# EAGLE schematic ArduFrauenfelderCNC (EAGLE 5.11)
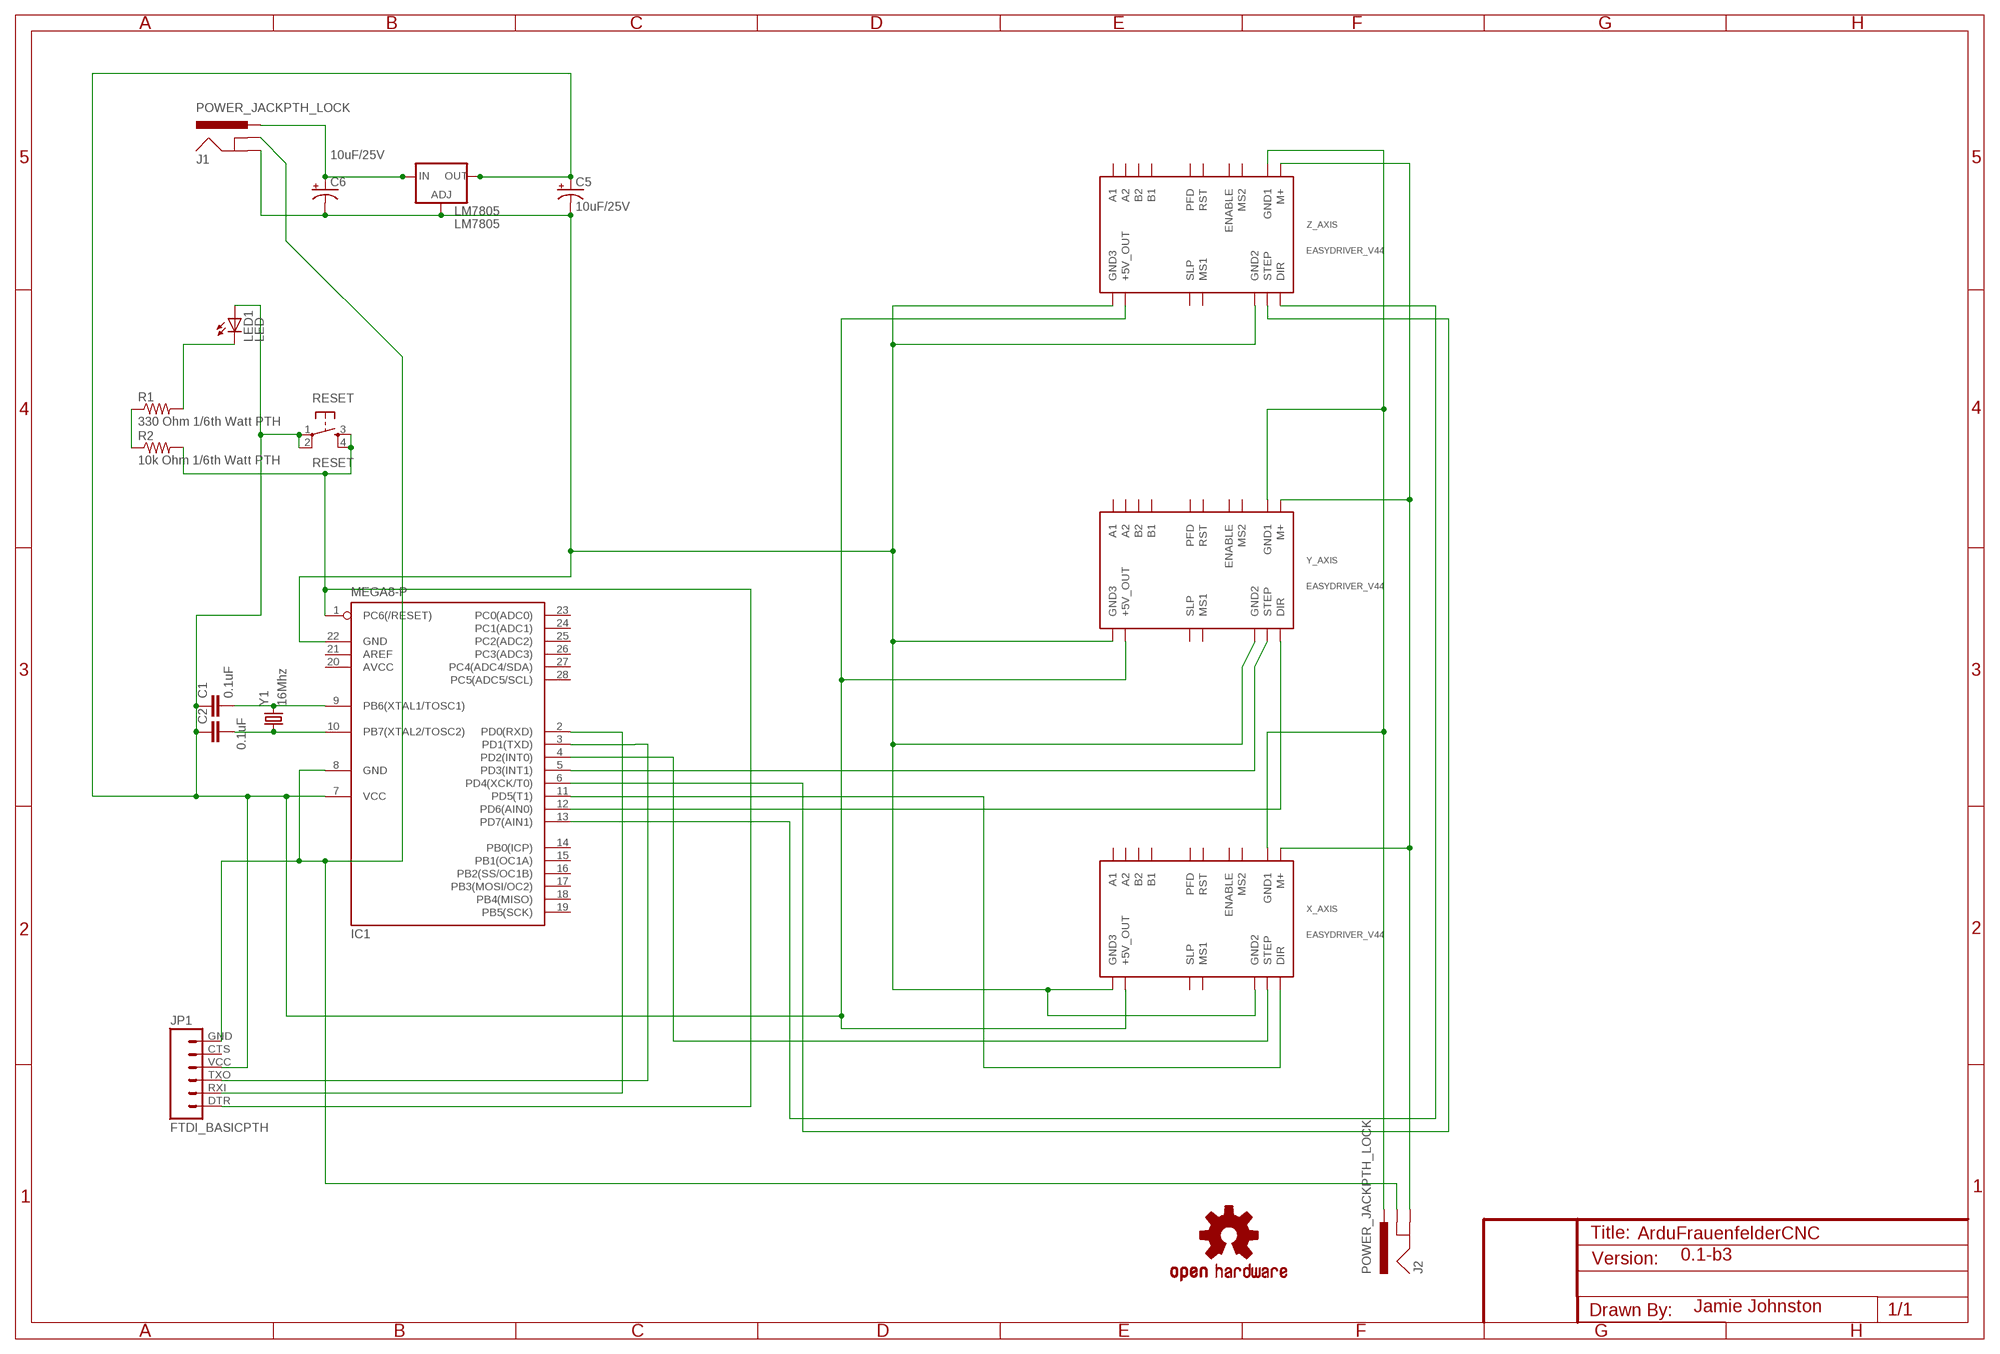
[diagram p0: schematic, sheet 1]

## Parts
C1  0.1uF  CAPPTH  [CAP-PTH-SMALL]
C2  0.1uF  CAPPTH  [CAP-PTH-SMALL]
C5  10uF/25V  CAP_POLPTH2  [CPOL-RADIAL-10UF-25V]
C6  10uF/25V  CAP_POLPTH2  [CPOL-RADIAL-10UF-25V]
IC1  MEGA8-P  [DIL28-3]
J1  POWER_JACKPTH_LOCK  [POWER_JACK_PTH_LOCK]
J2  POWER_JACKPTH_LOCK  [POWER_JACK_PTH_LOCK]
JP1  FTDI_BASICPTH  [FTDI_BASIC]
LED1  LED  LED5MM  [LED5MM]
LM7805  LM7805  V_REG_317SINK  [TO220-ADJ]
R1  330 Ohm 1/6th Watt PTH  RESISTORPTH-1/4W  [AXIAL-0.4]
R2  10k Ohm 1/6th Watt PTH  RESISTORPTH-1/4W  [AXIAL-0.4]
RESET  RESET  TAC_SWITCHPTH  [TACTILE-PTH]
U$2  OSHW-LOGOL  [OSHW-LOGO-L]
X_AXIS  EASYDRIVER_V44  [EASYDRIVER_V44]
Y1  16Mhz  CRYSTALHC49US  [HC49US]
Y_AXIS  EASYDRIVER_V44  [EASYDRIVER_V44]
Z_AXIS  EASYDRIVER_V44  [EASYDRIVER_V44]

## Nets
N$1: C1.2 IC1.9(PB6(XTAL1/TOSC1)) Y1.2
N$2: C2.2 IC1.10(PB7(XTAL2/TOSC2)) Y1.1
N$3: IC1.5(PD3(INT1)) Y_AXIS.STEP
N$4: LED1.K(C) R1.P$2
N$5: IC1.1(PC6(/RESET)) JP1.DTR R2.P$2 RESET.3 RESET.4
N$6: R1.P$1 R2.P$1
N$7: C6.1(+) J1.PWR LM7805.IN
N$9: C5.2(-) C6.2(-) IC1.22(GND) J1.GND LM7805.ADJ X_AXIS.GND2 X_AXIS.GND3 Y_AXIS.GND2 Y_AXIS.GND3 Z_AXIS.GND2 Z_AXIS.GND3
N$10: IC1.8(GND) J1.GNDBREAK J2.GNDBREAK JP1.GND
N$11: IC1.3(PD1(TXD)) JP1.TXO
N$12: IC1.2(PD0(RXD)) JP1.RXI
N$13: IC1.12(PD6(AIN0)) Y_AXIS.DIR
N$14: IC1.4(PD2(INT0)) X_AXIS.STEP
N$15: J2.PWR X_AXIS.GND1 Y_AXIS.GND1 Z_AXIS.GND1
N$16: IC1.11(PD5(T1)) X_AXIS.DIR
N$17: C1.1 C2.1 C5.1(+) IC1.7(VCC) JP1.VCC LED1.A LM7805.OUT RESET.1 RESET.2 X_AXIS.P$11(+5V_OUT) Y_AXIS.P$11(+5V_OUT) Z_AXIS.P$11(+5V_OUT)
N$18: J2.GND X_AXIS.M+ Y_AXIS.M+ Z_AXIS.M+
N$19: IC1.13(PD7(AIN1)) Z_AXIS.DIR
N$20: IC1.6(PD4(XCK/T0)) Z_AXIS.STEP
Unconnected: IC1.14(PB0(ICP)) IC1.15(PB1(OC1A)) IC1.16(PB2(SS/OC1B)) IC1.17(PB3(MOSI/OC2)) IC1.18(PB4(MISO)) IC1.19(PB5(SCK)) IC1.21(AREF) IC1.23(PC0(ADC0)) IC1.24(PC1(ADC1)) IC1.25(PC2(ADC2)) IC1.26(PC3(ADC3)) IC1.27(PC4(ADC4/SDA)) IC1.28(PC5(ADC5/SCL)) JP1.CTS X_AXIS.A1 X_AXIS.A2 X_AXIS.B1 X_AXIS.B2 X_AXIS.ENABLE X_AXIS.MS1 X_AXIS.MS2 X_AXIS.PFD X_AXIS.RST X_AXIS.SLEEP(SLP) Y_AXIS.A1 Y_AXIS.A2 Y_AXIS.B1 Y_AXIS.B2 Y_AXIS.ENABLE Y_AXIS.MS1 Y_AXIS.MS2 Y_AXIS.PFD Y_AXIS.RST Y_AXIS.SLEEP(SLP) Z_AXIS.A1 Z_AXIS.A2 Z_AXIS.B1 Z_AXIS.B2 Z_AXIS.ENABLE Z_AXIS.MS1 Z_AXIS.MS2 Z_AXIS.PFD Z_AXIS.RST Z_AXIS.SLEEP(SLP)

## Notes on the sheet
- 0.1-b3
- Jamie Johnston

## Power pins joined to a net without a drawn wire
AVCC: IC1.20(AVCC)

## Library data of the parts
C1 C2 = SparkFun:CAP: Capacitor Standard 0603 ceramic capacitor, and 0.1" leaded capacitor.
C5 C6 = SparkFun:CAP_POL: Capacitor Polarized These are standard SMD and PTH capacitors. Normally 10uF, 47uF, and 100uF in electrolytic and tantalum varieties. Always verify the external diameter of the through hole cap, it varies with capacity, voltage, and manufacturer. The EIA devices should be standard.
IC1 = atmel:MEGA8-P: MICROCONTROLLER 8 Kbytes FLASH, 1 kbytes SRAM, 512 bytes EEPROM, USART, 4-channel 10 bit ADC, 2-channel 8 bit ADC Pin compatible with Atmega48, ATMega88, ATMega168 Source: avr.lbr; OC_FARNELL: unknown; OC_NEWARK: unknown
J1 J2 = SparkFun:POWER_JACK: Power Jack This is the standard 5.5mm barrel jack for power. The PTH is the most common, proven, reliable, footprint. All others are experimental. The Slot footprint only works if the mill layer is transmitted to the PCB fab house so be warned. Spark Fun Electronics SKU : PRT-00119. Mating wall wart : TOL-00298 (and others)
JP1 = SparkFun:FTDI_BASIC: FTDI Basic: 3.3V and 5V
LED1 = SparkFun:LED: LEDs Standard schematic elements and footprints for 5mm, 3mm, 1206, and 0603 sized LEDs. 5mm - Spark Fun Electronics SKU : COM-00529 (and others)
LM7805 = SparkFun:V_REG_317: Voltage Regulator Standard LM317 adjustable voltage regulator. AOI (Adjust Output Input). Google 'LM317 Calculator' for easy to use app to get the two resistor values needed. 240/720 for 5V output. 240/390 for 3.3V output. Spark Fun Electronics SKU : COM-00527
R1 R2 = SparkFun:RESISTOR: Resistor Basic schematic elements and footprints for 0603, 1206, and PTH resistors.
RESET = SparkFun:TAC_SWITCH: Momentary Switch Button commonly used for reset or general input. Spark Fun Electronics SKU : COM-00097
U$2 = SparkFun:OSHW-LOGO: Open Source Hardware Logo This logo indicates the piece of hardware it is found on incorporates a OSHW license and/or adheres to the definition of open source hardware found here: http://freedomdefined.org/OSHW
X_AXIS Y_AXIS Z_AXIS = EasyDriver:EASYDRIVER_V44: EasyDriver version 4.4 - http://www.schmalzhaus.com/EasyDriver
Y1 = SparkFun:CRYSTAL: Crystals Various standard crystals. Proven footprints. Spark Fun Electronics SKU : COM-00534